# EAGLE schematic esp8266_01 (EAGLE 7.5.0)
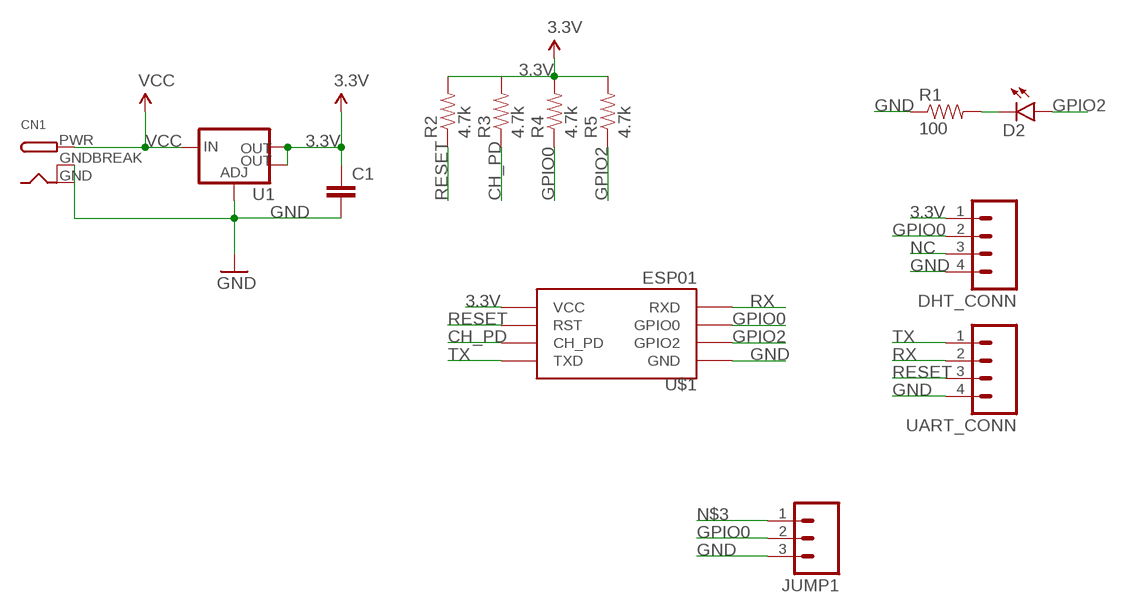
[diagram p0: schematic, sheet 1]

## Parts
C1  CAP0805  [0805]
CN1  DCBARRELPTH  [DCJACK_2MM_PTH]
D2  LED5MM  [LED5MM]
DHT_CONN  M04LONGPADS  [1X04_LONGPADS]
JUMP1  M03LOCK_LONGPADS  [1X03_LOCK_LONGPADS]
R1  100  RESISTOR0805-RES  [0805]
R2  4.7k  RESISTOR0805-RES  [0805]
R3  4.7k  RESISTOR0805-RES  [0805]
R4  4.7k  RESISTOR0805-RES  [0805]
R5  4.7k  RESISTOR0805-RES  [0805]
U1  V_REG_LM1117SOT223  [SOT223]
U$1  ESP01  [ESP01]
UART_CONN  M04LONGPADS  [1X04_LONGPADS]

## Nets
3.3V: C1.1 DHT_CONN.1 R2.2 R3.2 R4.2 R5.2 U1.2(OUT) U1.4(OUT) U$1.VCC
CH_PD: R3.1 U$1.CH_PD
GND: C1.2 CN1.GND CN1.GNDBREAK DHT_CONN.4 JUMP1.3 R1.1 U1.1(ADJ) U$1.GND UART_CONN.4
GPIO0: DHT_CONN.2 JUMP1.2 R4.1 U$1.GPIO0
GPIO2: D2.A R5.1 U$1.GPIO2
N$1: D2.K(C) R1.2
N$3: JUMP1.1
NC: DHT_CONN.3
RESET: R2.1 U$1.RST UART_CONN.3
RX: U$1.RX(RXD) UART_CONN.2
TX: U$1.TX(TXD) UART_CONN.1
VCC: CN1.PWR U1.3(IN)

## Library data of the parts
C1 = SparkFun-Capacitors:CAP: Capacitor Standard 0603 ceramic capacitor, and 0.1" leaded capacitor.
CN1 = adafruit:DCBARREL: 2.0mm DC Barrel Jack DCJACK_2MM_PTH - Through Hole Jack (4UConnector: 05537)
D2 = SparkFun-LED:LED: LEDs Standard schematic elements and footprints for 5mm, 3mm, 1206, and 0603 sized LEDs. 5mm - Spark Fun Electronics SKU : COM-00529 (and others)
DHT_CONN UART_CONN = SparkFun-Connectors:M04: Header 4 Standard 4-pin 0.1" header. Use with straight break away headers (SKU : PRT-00116), right angle break away headers (PRT-00553), swiss pins (PRT-00743), machine pins (PRT-00117), and female headers (PRT-00115). Molex polarized connector foot print use with SKU : PRT-08231 with associated crimp pins and housings. 1MM SMD Version SKU: PRT-10208; PROD_ID: CONN-09696
JUMP1 = SparkFun-Connectors:M03: Header 3 Standard 3-pin 0.1" header. Use with straight break away headers (SKU : PRT-00116), right angle break away headers (PRT-00553), swiss pins (PRT-00743), machine pins (PRT-00117), and female headers (PRT-00115). Molex polarized connector foot print use with SKU : PRT-08232 with associated crimp pins and housings.
R1-R5 = SparkFun-Resistors:RESISTOR: Resistor Basic schematic elements and footprints for 0603, 1206, and PTH resistors.
U1 = SparkFun-PowerIC:V_REG_LM1117: Voltage Regulator LM1117 Standard adjustable voltage regulator but in SMD form. Spark Fun Electronics SKU : COM-00595; PROD_ID: VREG-08170
U$1 = esp8266modules:ESP01: ESP8266 Wifi module 01

## Net classes
0 default: width 0.508 mm, drill 0.254 mm, clearance 0.254 mm